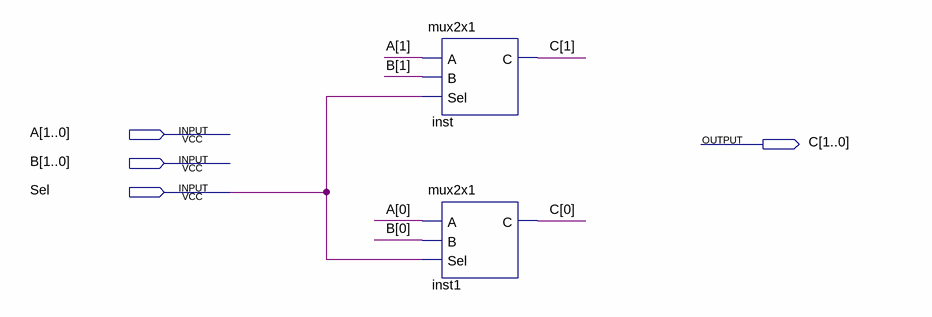
[diagram p0: schematic sheet]
// Quartus schematic mux2x2.bdf as structural Verilog: 2 symbols, 4 pins
module mux2x2 (
  input  [1:0] A,
  input  [1:0] B,
  input  Sel,
  output [1:0] C
);

  mux2x1 inst (.A(A[1]), .B(B[1]), .Sel(Sel), .C(C[1]));
  mux2x1 inst1 (.A(A[0]), .B(B[0]), .Sel(Sel), .C(C[0]));
endmodule
